# EAGLE schematic fancontrol_attiny (EAGLE 6.4)
Fan control
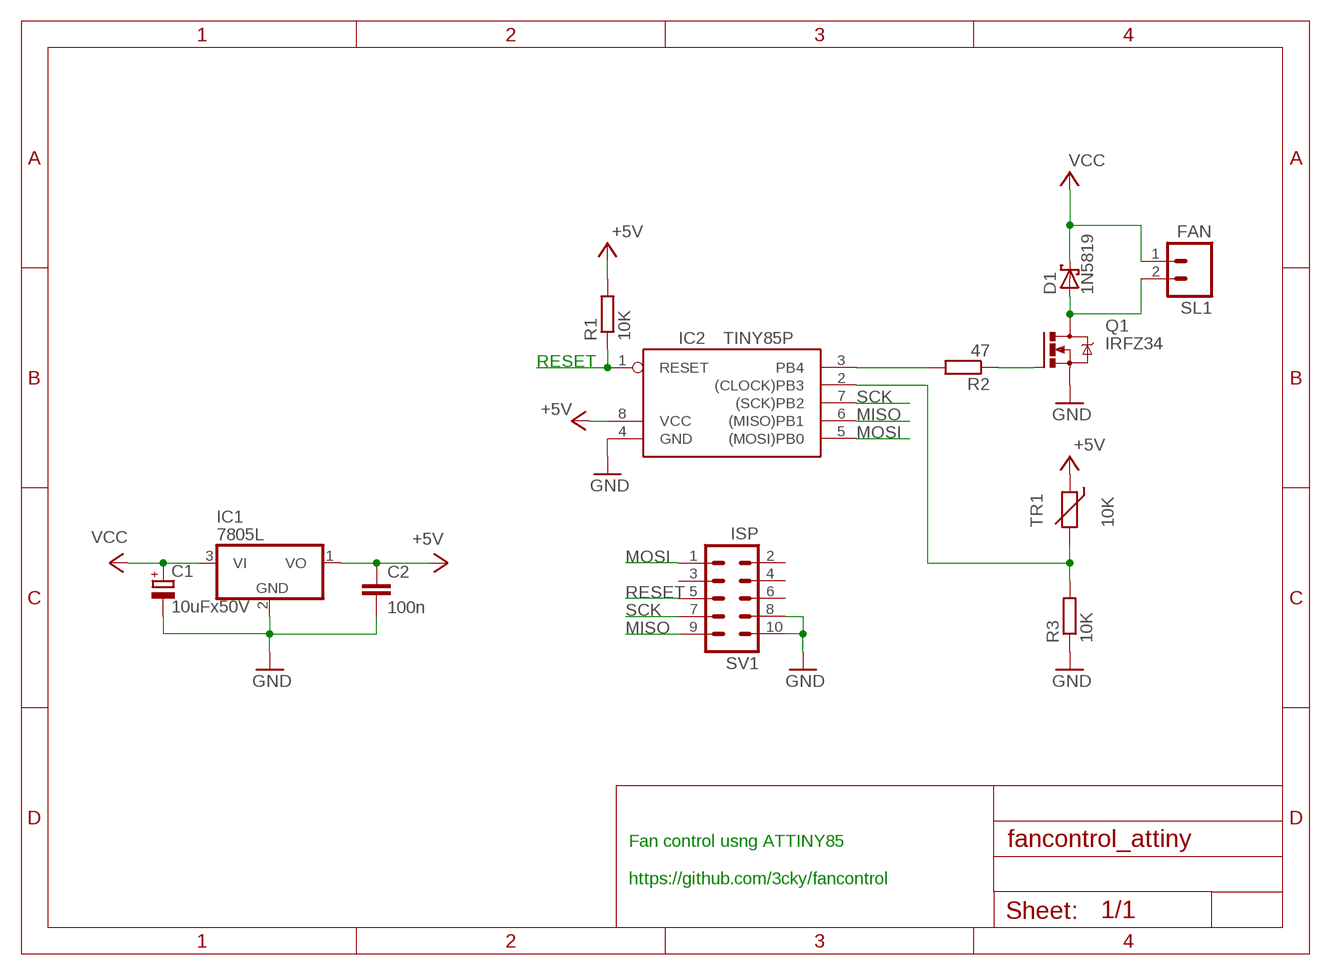
[diagram p0: schematic, sheet 1]

## Parts
C1  10uFx50V  CPOL-EUE5-5  [E5-5]
C2  100n  C-EU025-024X044  [C025-024X044]
D1  1N5819  1N5819-B  [DO41-7.6]
IC1  7805L  [TO92]
IC2  TINY85P  TINY22P  [DIL08]
Q1  IRFZ34  IRFZ48Z  [TO220BH]
R1  10K  R-EU_M0805  [M0805]
R2  47  R-EU_M0805  [M0805]
R3  10K  R-EU_M0805  [M0805]
SL1  FAN  M02  [02P]
SV1  ISP  MA05-2  [MA05-2]
TR1  10K  THERMISTOR_R-5  [R-5]

## Nets
+5V: C2.1 IC1.1(VO) IC2.8(VCC) R1.2 TR1.1
GND: C1.- C2.2 IC1.2(GND) IC2.4(GND) Q1.S R3.1 SV1.8 SV1.10
MISO: IC2.6((MISO)PB1) SV1.9
MOSI: IC2.5((MOSI)PB0) SV1.1
N$2: IC2.2((CLOCK)PB3) R3.2 TR1.2
N$3: IC2.3(PB4) R2.2
N$4: Q1.G R2.1
N$10: D1.A Q1.D SL1.2
RESET: IC2.1(RESET) R1.1 SV1.5
SCK: IC2.7((SCK)PB2) SV1.7
VCC: C1.+ D1.C IC1.3(VI) SL1.1
Unconnected: SV1.2 SV1.3 SV1.4 SV1.6

## Notes on the sheet
- Fan control usng ATTINY85
  
  https://github.com/3cky/fancontrol

## Library data of the parts
C1 = resistor:CPOL-EU: POLARIZED CAPACITOR, European symbol
C2 = resistor:C-EU: CAPACITOR, European symbol
D1 = diode:1N581*: 1.0A SCHOTTKY BARRIER RECTIFIER Source: http://www.diodes.com/datasheets/ds23001.pdf
IC1 = linear:78*: Positive VOLTAGE REGULATOR Source: http://cache.national.com/ds/LM/LM78L05.pdf http://www.fairchildsemi.com/ds/LM/LM7805.pdf
IC2 = atmel:TINY22: MICROCONTROLLER 1K ROM 128 bytes RAM 128 bytes EEPROM; OC_FARNELL: unknown; OC_NEWARK: unknown
Q1 = transistor-power:IRFZ48: N Channel HEXFET® Power MOSFET Logic Level Source: http://www.irf.com/product-info/datasheets/data/irfz48z.pdf
R1-R3 = resistor:R-EU_: RESISTOR, European symbol
SL1 = con-amp-quick:M02: AMP QUICK CONNECTOR; OC_FARNELL: unknown; OC_NEWARK: unknown
SV1 = con-lstb:MA05-2: PIN HEADER; OC_FARNELL: unknown; OC_NEWARK: unknown
TR1 = discrete:THERMISTOR_: Thermo Resistor